# Altium schematic sheet ICs.SchDoc
size A3
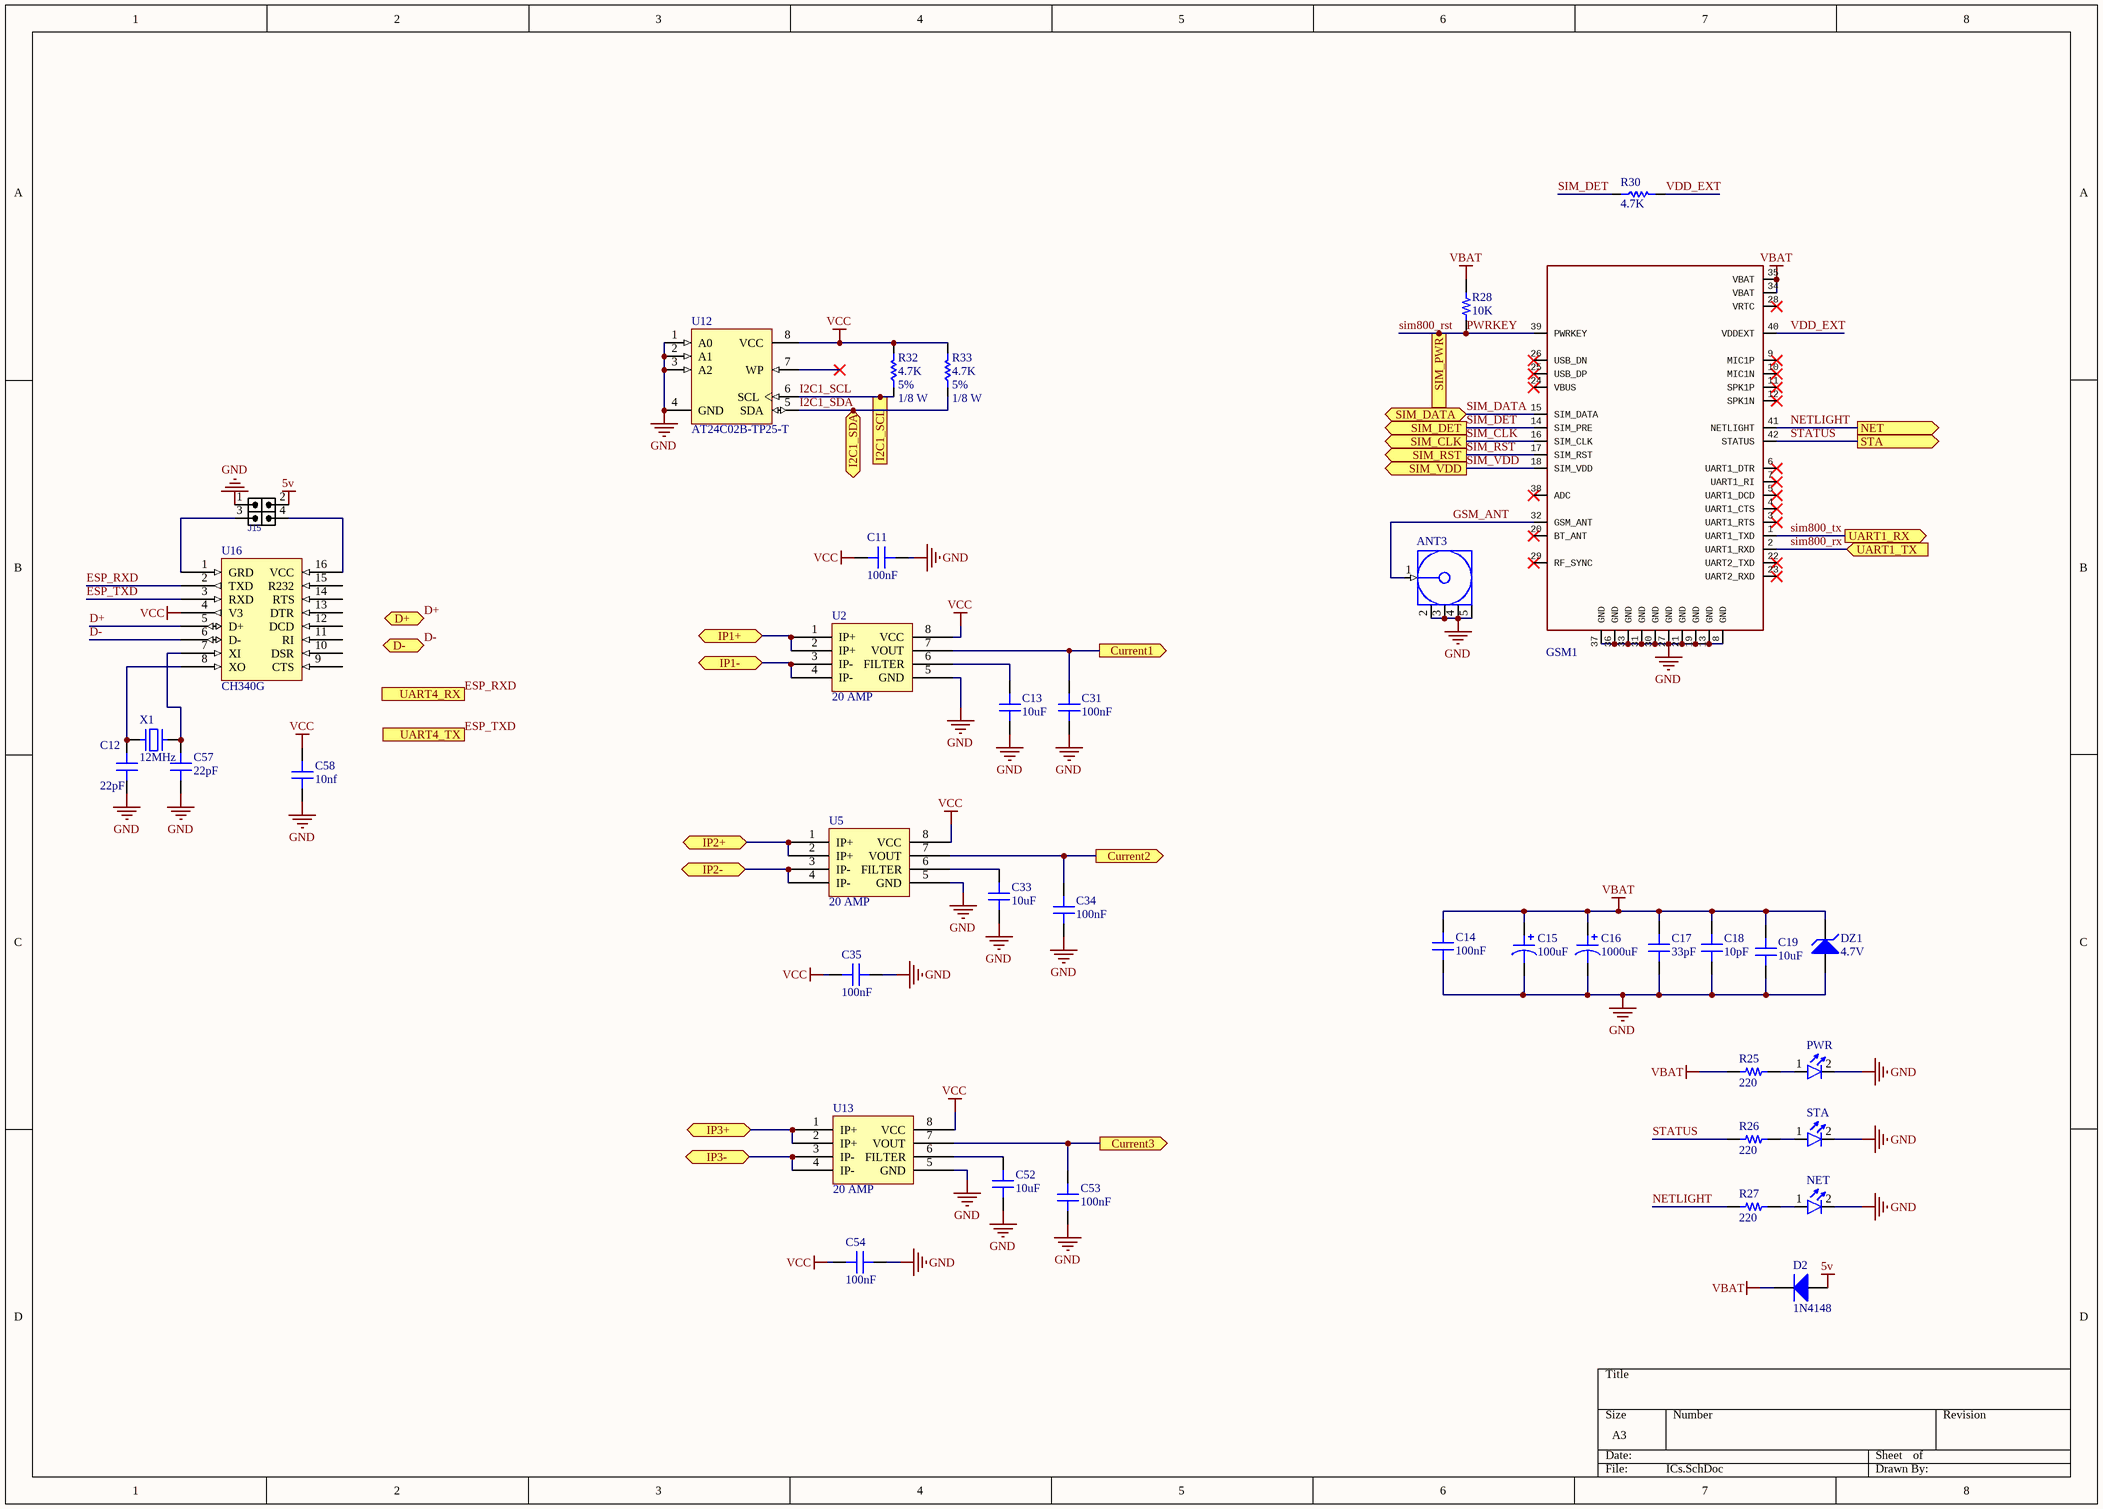
[diagram p0: ICs.SchDoc]

## Parts
ANT3  SMA  [SMA_RA]  (value not drawn)
C11  100nF  [CAP 0603_1608]
C12  22pF  [CAP 0805]
C13  10uF  [CAP 0805]
C14  100nF  [CAP 0805]
C15  100uF  [CAP TAN SMD 3528]
C16  1000uF  [CAP ALSMD POLY 8.3MM H8.0MM]
C17  33pF  [CAP 0805]
C18  10pF  [CAP 0805]
C19  10uF  [CAP 0805]
C31  100nF  [CAP 0603_1608]
C33  10uF  [CAP 0805]
C34  100nF  [CAP 0603_1608]
C35  100nF  [CAP 0603_1608]
C52  10uF  [CAP 0805_2012]
C53  100nF  [CAP 0603_1608]
C54  100nF  [CAP 0603_1608]
C57  22pF  [CAP 0805]
C58  10nf  [CAP 0805]
D2  Parameter 1: 1N4148  [DO-214AA SMB]  (hidden comment: 1N4148 SMD)
DZ1  value 4.7V  [SOD80]  (hidden comment: Zener 0.5W SMD)
GSM1  (no value)  [SIM800C_M]
J15  HDRM_2X2  [HDR_M_2X2]  (value not drawn)
NET  (no value)  [LED_0603_GREEN]
PWR  (no value)  [LED_0603_RED]
R25  220  [RES 0805]
R26  220  [RES 0805]
R27  220  [RES 0805]
R28  10K  [RES 0805]
R30  4.7K  [RES 0603_1608]
R32  Tolerance: 5%  Power: 1/8 W  [RES 0603_1608]  (hidden comment: 4.7K)
R33  Tolerance: 5%  Power: 1/8 W  [RES 0603_1608]  (hidden comment: 4.7K)
STA  (no value)  [LED_0603_BLUE]
U2  20 AMP  [SOIC_8pin]
U5  20 AMP  [SOIC_8pin]
U12  AT24C02B-TP25-T  [SO8_N]
U13  20 AMP  [SOIC_8]
U16  CH340G  [SOP16]
X1  Parameter 1: 12MHz  [XTAL THD HC49]

## Ports
Current1 (out), Current2 (out), Current3 (out), D+ (bidir), D- (bidir), I2C1_SCL (in), I2C1_SDA (bidir), IP1+ (bidir), IP1- (bidir), IP2+ (bidir), IP2- (bidir), IP3+ (bidir), IP3- (bidir), NET (out), SIM_CLK (out), SIM_DATA (bidir), SIM_DET (out), SIM_PWR (in), SIM_RST (out), SIM_VDD (out), STA (out), UART1_RX (out), UART1_TX (in), UART4_RX (out), UART4_TX (out)

## Nets
5v: D2.1(A) J15.2
GND: ANT3.2(GND) ANT3.3(GND) ANT3.4(GND) ANT3.5(GND) C11.1 C12.1 C13.1 C14.1 C15.2 C16.2 C17.1 C18.1 C19.1 C31.1 C33.1 C34.2 C35.1 C52.1 C53.2 C54.1 C57.1 C58.1 DZ1.1(A) GSM1.8(GND) GSM1.13(GND) GSM1.19(GND) GSM1.21(GND) GSM1.27(GND) GSM1.30(GND) GSM1.31(GND) GSM1.33(GND) GSM1.36(GND) GSM1.37(GND) J15.1 NET.2(K) PWR.2(K) STA.2(K) U2.5(GND) U5.5(GND) U12.1(A0) U12.2(A1) U12.3(A2) U12.4(GND) U13.5(GND)
VBAT: C14.2 C15.1 C16.1 C17.2 C18.2 C19.2 D2.2(K) DZ1.2(K) GSM1.34(VBAT) GSM1.35(VBAT) R25.2 R28.2
VCC: C11.2 C35.2 C54.2 C58.2 R32.2 R33.2 U2.8(VCC) U5.8(VCC) U12.8(VCC) U13.8(VCC) U16.4(V3)
Current1: C31.2 U2.7(VOUT) ; port Current1
Current2: C34.1 U5.7(VOUT) ; port Current2
Current3: C53.1 U13.7(VOUT) ; port Current3
D+: U16.5(D+) ; port D+
D-: U16.6(D-) ; port D-
ESP_RXD: U16.2(TXD) ; port UART4_RX
ESP_TXD: U16.3(RXD) ; port UART4_TX
GSM_ANT: ANT3.1(Signal) GSM1.32(GSM_ANT)
I2C1_SCL: R32.1 U12.6(SCL) ; port I2C1_SCL
I2C1_SDA: R33.1 U12.5(SDA) ; port I2C1_SDA
IP1+: U2.1(IP+) U2.2(IP+) ; port IP1+
IP1-: U2.3(IP-) U2.4(IP-) ; port IP1-
IP2+: U5.1(IP+) U5.2(IP+) ; port IP2+
IP2-: U5.3(IP-) U5.4(IP-) ; port IP2-
IP3+: U13.1(IP+) U13.2(IP+) ; port IP3+
IP3-: U13.3(IP-) U13.4(IP-) ; port IP3-
NETLIGHT: GSM1.41(NETLIGHT) R27.2 ; port NET
PWRKEY: GSM1.39(PWRKEY) R28.1 ; port SIM_PWR  [also labelled sim800_rst]
sim800_rx: GSM1.2(UART1_RXD) ; port UART1_TX
sim800_tx: GSM1.1(UART1_TXD) ; port UART1_RX
SIM_CLK: GSM1.16(SIM_CLK) ; port SIM_CLK
SIM_DATA: GSM1.15(SIM_DATA) ; port SIM_DATA
SIM_DET: GSM1.14(SIM_PRE) R30.1 ; port SIM_DET
SIM_RST: GSM1.17(SIM_RST) ; port SIM_RST
SIM_VDD: GSM1.18(SIM_VDD) ; port SIM_VDD
STATUS: GSM1.42(STATUS) R26.2 ; port STA
VDD_EXT: GSM1.40(VDDEXT) R30.2
NetC12_2: C12.2 U16.8(XO) X1.1
NetC13_2: C13.2 U2.6(FILTER)
NetC33_2: C33.2 U5.6(FILTER)
NetC52_2: C52.2 U13.6(FILTER)
NetC57_2: C57.2 U16.7(XI) X1.2
NetJ15_3: J15.3 U16.1(GRD)
NetJ15_4: J15.4 U16.16(VCC)
NetNET_1: NET.1(A) R27.1
NetPWR_1: PWR.1(A) R25.1
NetR26_1: R26.1 STA.1(A)

Not connected (* = marked no-connect by the designer): GSM1 3(UART1_RTS)* 4(UART1_CTS)* 5(UART1_DCD)* 6(UART1_DTR)* 7(UART1_RI)* 9(MIC1P)* 10(MIC1N)* 11(SPK1P)* 12(SPK1N)* 20(BT_ANT)* 22(UART2_TXD)* 23(UART2_RXD)* 24(VBUS)* 25(USB_DP)* 26(USB_DN)* 28(VRTC)* 29(RF_SYNC)* 38(ADC)*; U12 7(WP)*; U16 9(CTS) 10(DSR) 11(RI) 12(DCD) 13(DTR) 14(RTS) 15(R232)

## Library data of the parts
ANT3 = SMA RA: RF Coaxial PCB Connector, MCX; Thru-Hole, Right-Angle Mount Socket, Blunt Post Terminal, 50 Ohm Impedance
C11-C14 C17-C19 C31 C33-C35 C52-C54 C57 C58 = Cap SMD 0805: SMT Capacitor
  C11 C14 C31 C34 C35 C53 C54: Value: 100nF
  C12 C57: Value: 22pF
  C13 C19 C33 C52: Value: 10uF
  C17: Value: 33pF
  C18: Value: 10pF
  C58: Value: 10nf
C15 = Pol Cap SMD TAN 3528 SIZE B: SMT TAN Polarised Capacitor; Value: 100uF
C16 = Pol Cap SMD AL D4 H4: SMT Polarised Capacitor; Value: 1000uF
D2 = 1N4148 SMD: Signal Diode
DZ1 = Zener 0.5W SMD: 0.5W Zener
GSM1 = SIM800C
J15 = HDR_M_2X2: CONN, HEADER, Male, pitch: 2.54mm, 4POS; MANF_P#: MANF_PART#; MANF: MANF; VALUE: HDRM_2X2
NET PWR STA = LED: Designer: Saeid Jorablo; Organazation: ControTec; Adding Date: 1387/12/22
R25-R28 = Res SMD 0805: SMD Resistor
  R25-R27: Value: 220
  R28: Value: 10K
R30 R32 R33 = Resistor: Value: 4.7K
U2 U5 U13 = ACS712: Current Sensor
U12 = AT24C02B-TP25-T: 2Kbit (256 x 8), 2-wire Bus Automotive Serial EEPROM with full memory Write Protect, 2.5V, 8-Pin TSSOP, Tape & Reel; DatasheetVersion: 8517C,  Jan-2009; PackageVersion: revD, Dec-2009; PackageReference: 8A2; PackageDescription: 8-Lead, 4.4 mm Body, Plastic Thin Shrink Small Outline Package (TSSOP); Code_JEDEC: MO-153-AA; ComponentLink1Description: Manufacturer URL; ComponentLink1URL: http://www.atmel.com/; ComponentLink2Description: Datasheet; ComponentLink2URL: http://www.atmel.com/dyn/resources/prod_documents/doc8517.pdf
X1 = Crystal THD HC49: SMT Crystal